# Altium schematic sheet rd.SchDoc
size 660 x 381 mm; SheetNumber: 1; SheetTotal: 1
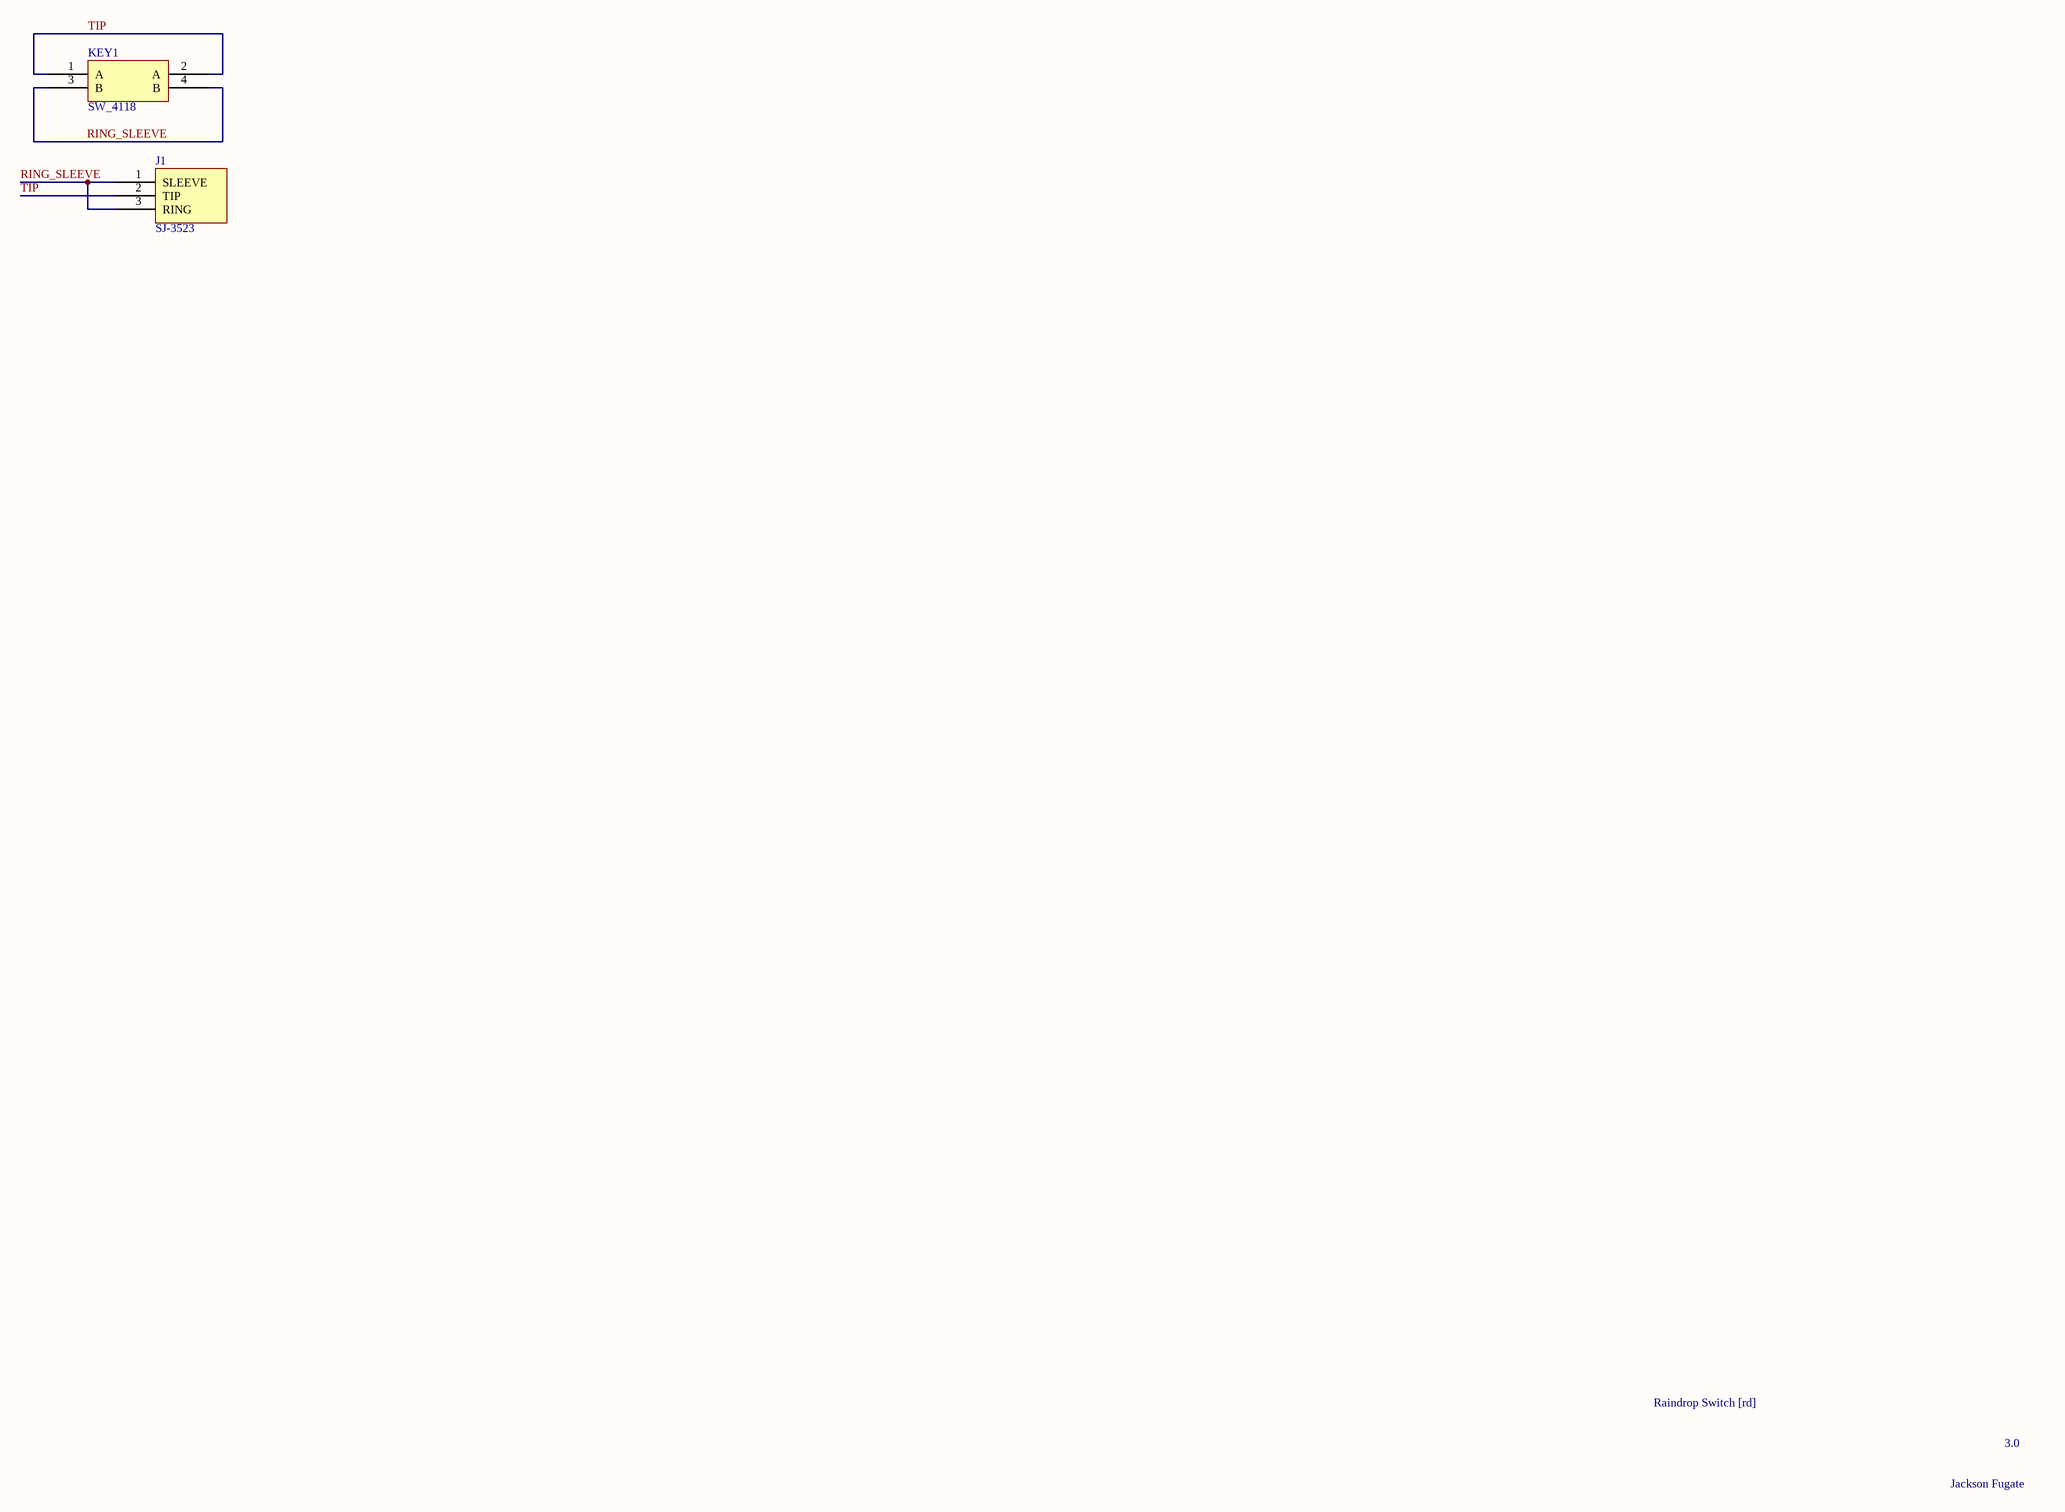
[diagram p0: rd.SchDoc]

## Parts
J1  SJ-3523  [SJ-352X]
KEY1  SW_4118  [SW_4118]

## Nets
RING_SLEEVE: J1.1(SLEEVE) J1.3(RING) KEY1.3(B) KEY1.4(B)
TIP: J1.2(TIP) KEY1.1(A) KEY1.2(A)

## Notes on the sheet
- Raindrop Switch [rd]
- 3.0
- Jackson Fugate